# Altium schematic sheet Connector - Registered Jack.SchDoc
size A4; SheetNumber: 19; SheetTotal: 41
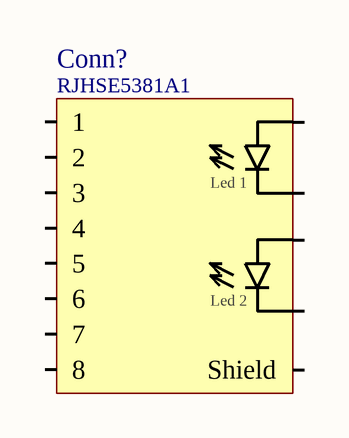
[diagram p0: Connector - Registered Jack.SchDoc]

## Parts
Conn?  Manufacturer Part Number: RJHSE5381A1  [RJ45 - Amphenol, RJHSE-x38x-A1]  (hidden comment: RJ45 - Amphenol, RJHSE-x38x-A1)

## Nets

Not connected (* = marked no-connect by the designer): Conn? 1 2 3 4 5 6 7 8 L1-A L1-C L2-A L2-C Shield

## Notes on the sheet
- (in symbol RJ45 - Amphenol, RJHSE-x38x-A1) Led 1; Led 2

## Library data of the parts
Conn? = RJ45 - Amphenol, RJHSE-x38x-A1: Conn, RJ45, 2 Leds, Shielded, Side Entry; Component Category: Connector; ComponentLink1Description: Datasheet; ComponentLink1URL: E:\Altium\Datasheets\Connector - Registered Jack\RJ45 - Amphenol, RJHSE-x38x-A1.pdf; ComponentLink2Description: Supplier Link; ComponentLink2URL: https://www.digikey.com/en/products/detail/amphenol-cs-commercial-products/RJHSE5381A1/3083556; Supplier: Digikey; Supplier Part Number: RJHSE5381A1-ND; Manufacturer: Amphenol; Operating Temperature, Min: -55℃; Operating Temperature, Max: +85℃; Quantity, Min: 1; Quantity, Max: 2400; Price, Min: 1.51; Supplier Currency: $; Price, Max: 0.806; Supplier Link: https://www.digikey.com/en/products/detail/amphenol-cs-commercial-products/RJHSE5381A1/3083556; Component Type: PCB; Package: RJ45